# EAGLE design candy_v0001 (EAGLE 7.2.0)
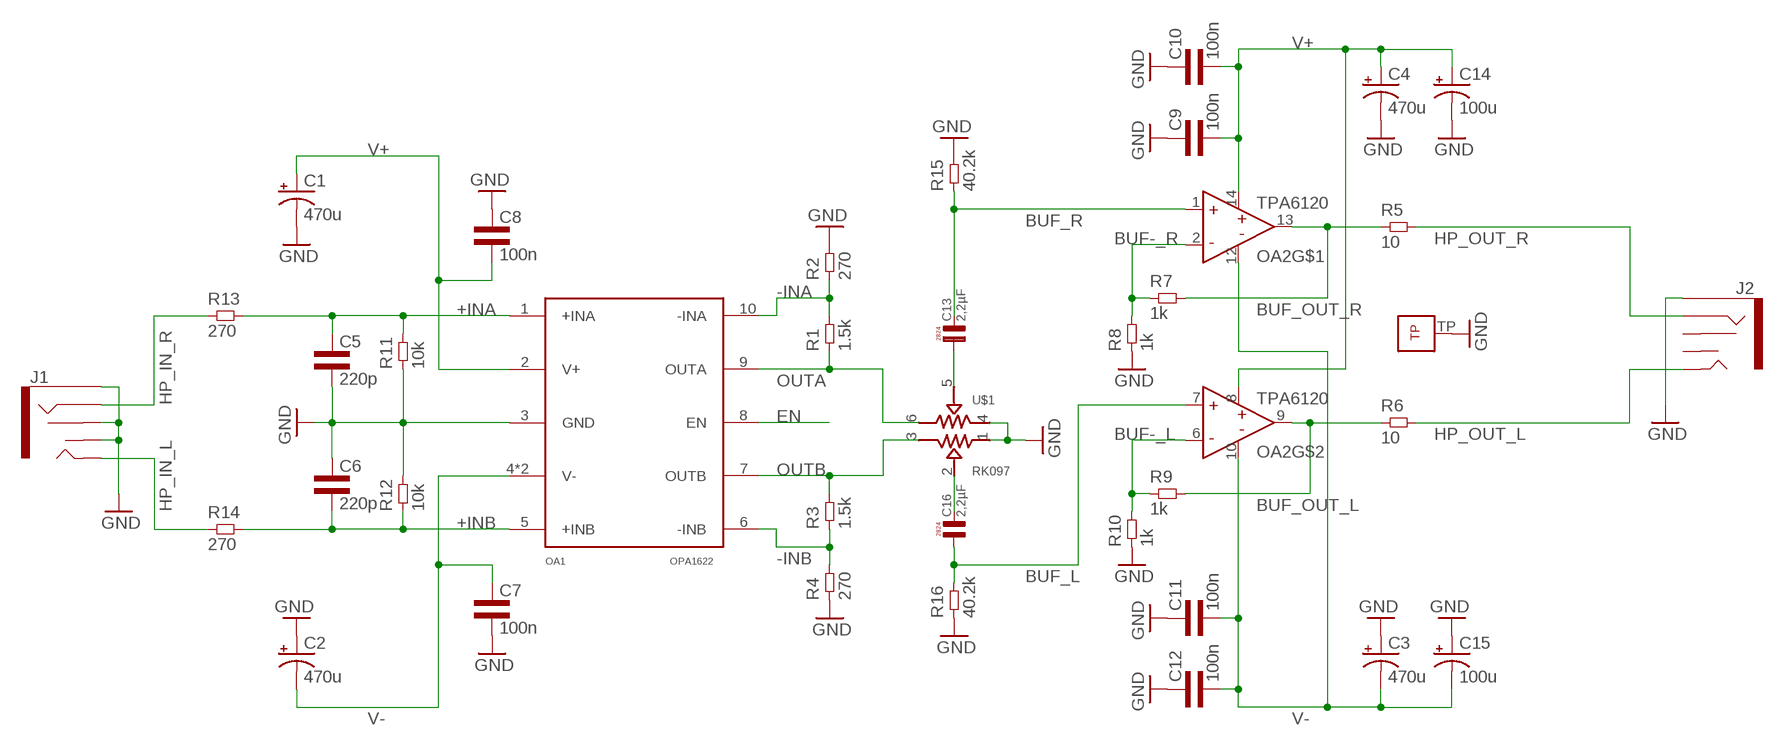
[diagram p0: schematic, sheet 1]

## Parts
C1  470u  CPOL-USF  [PANASONIC_F]
C2  470u  CPOL-USF  [PANASONIC_F]
C3  470u  CPOL-USF  [PANASONIC_F]
C4  470u  CPOL-USF  [PANASONIC_F]
C5  220p  CAP0805L3  [0805L3]
C6  220p  CAP0805L3  [0805L3]
C7  100n  CAP0603L3  [0603L3]
C8  100n  CAP0603L3  [0603L3]
C9  100n  CAP0603L3  [0603L3]
C10  100n  CAP0603L3  [0603L3]
C11  100n  CAP0603L3  [0603L3]
C12  100n  CAP0603L3  [0603L3]
C13  2,2µF  [L7,2]
C14  100u  CPOL-USD  [PANASONIC_D]
C15  100u  CPOL-USD  [PANASONIC_D]
C16  2,2µF  [L7,2]
J1  AUDIO-JACK2SMD  [AUDIO-JACK-3.5MM-SMD]
J2  AUDIO-JACK2SMD  [AUDIO-JACK-3.5MM-SMD]
OA1  OPA1622  [S-PVSON-N10]
OA2  TPA6120QFN  [S-PVQFN-N14]
R1  1.5k  RES0603L3  [0603L3]
R2  270  RES0603L3  [0603L3]
R3  1.5k  RES0603L3  [0603L3]
R4  270  RES0603L3  [0603L3]
R5  10  RES1206L3  [1206L3]
R6  10  RES1206L3  [1206L3]
R7  1k  RES0603L3  [0603L3]
R8  1k  RES0603L3  [0603L3]
R9  1k  RES0603L3  [0603L3]
R10  1k  RES0603L3  [0603L3]
R11  10k  RES0603L3  [0603L3]
R12  10k  RES0603L3  [0603L3]
R13  270  RES0603L3  [0603L3]
R14  270  RES0603L3  [0603L3]
R15  40.2k  RES0603L3  [0603L3]
R16  40.2k  RES0603L3  [0603L3]
U$1  RK097  [RK097]

## Nets
+INA: C5.1 OA1.1(+INA) R11.P$2 R13.P$2
+INB: C6.2 OA1.5(+INB) R12.P$1 R14.P$2
-INA: OA1.10(-INA) R1.P$2 R2.P$1
-INB: OA1.6(-INB) R3.P$1 R4.P$2
BUF-_L: OA2.6(IN-) R9.P$1 R10.P$2
BUF-_R: OA2.2(IN-) R7.P$1 R8.P$2
BUF_L: C16.P$1 OA2.7(IN+) R16.P$2
BUF_OUT_L: OA2.9(OUT) R6.1 R9.P$2
BUF_OUT_R: OA2.13(OUT) R5.1 R7.P$2
BUF_R: C13.P$2 OA2.1(IN+) R15.P$1
EN: OA1.8(EN)
GND: C1.- C2.+ C3.+ C4.- C5.2 C6.1 C7.P$2 C8.P$1 C9.P$1 C10.P$1 C11.P$1 C12.P$1 C14.- C15.+ J1.RSH J1.SLEEVE J1.TSH J2.SLEEVE OA1.3(GND) OA2.TP R2.P$2 R4.P$1 R8.P$1 R10.P$1 R11.P$1 R12.P$2 R15.P$2 R16.P$1 U$1.1 U$1.4
HP_IN_L: J1.TIP R14.P$1
HP_IN_R: J1.RING R13.P$1
HP_OUT_L: J2.TIP R6.2
HP_OUT_R: J2.RING R5.2
OUTA: OA1.9(OUTA) R1.P$1 U$1.6
OUTB: OA1.7(OUTB) R3.P$2 U$1.3
V+: C1.+ C4.+ C8.P$2 C9.P$2 C10.P$2 C14.+ OA1.2(V+) OA2.8(V+) OA2.14(V+)
V-: C2.- C3.- C7.P$1 C11.P$2 C12.P$2 C15.- OA1.4(V-) OA1.TP(V-) OA2.10(V-) OA2.12(V-)
VOL_L: C16.P$2 U$1.2
VOL_R: C13.P$1 U$1.5
Unconnected: J2.RSH J2.TSH

## Library data of the parts
C1-C4 C14 C15 = rcl:CPOL-US: POLARIZED CAPACITOR, American symbol
C5-C12 = common:CAP
C13 C16 = Capacitor-Wima-SMD2824-63v:2,2µF
J1 J2 = SparkFun-Connectors:AUDIO-JACK2: Stereo audio jack with bypass switches. Used on LilyPad MP3 board. Production SKU: CONN-10353; PROD_ID: CONN-10353
OA1 = common:OPA1622
OA2 = common:TPA6120
R1-R16 = common:RES
U$1 = SparkFun-Electromechanical:RK097

## Board
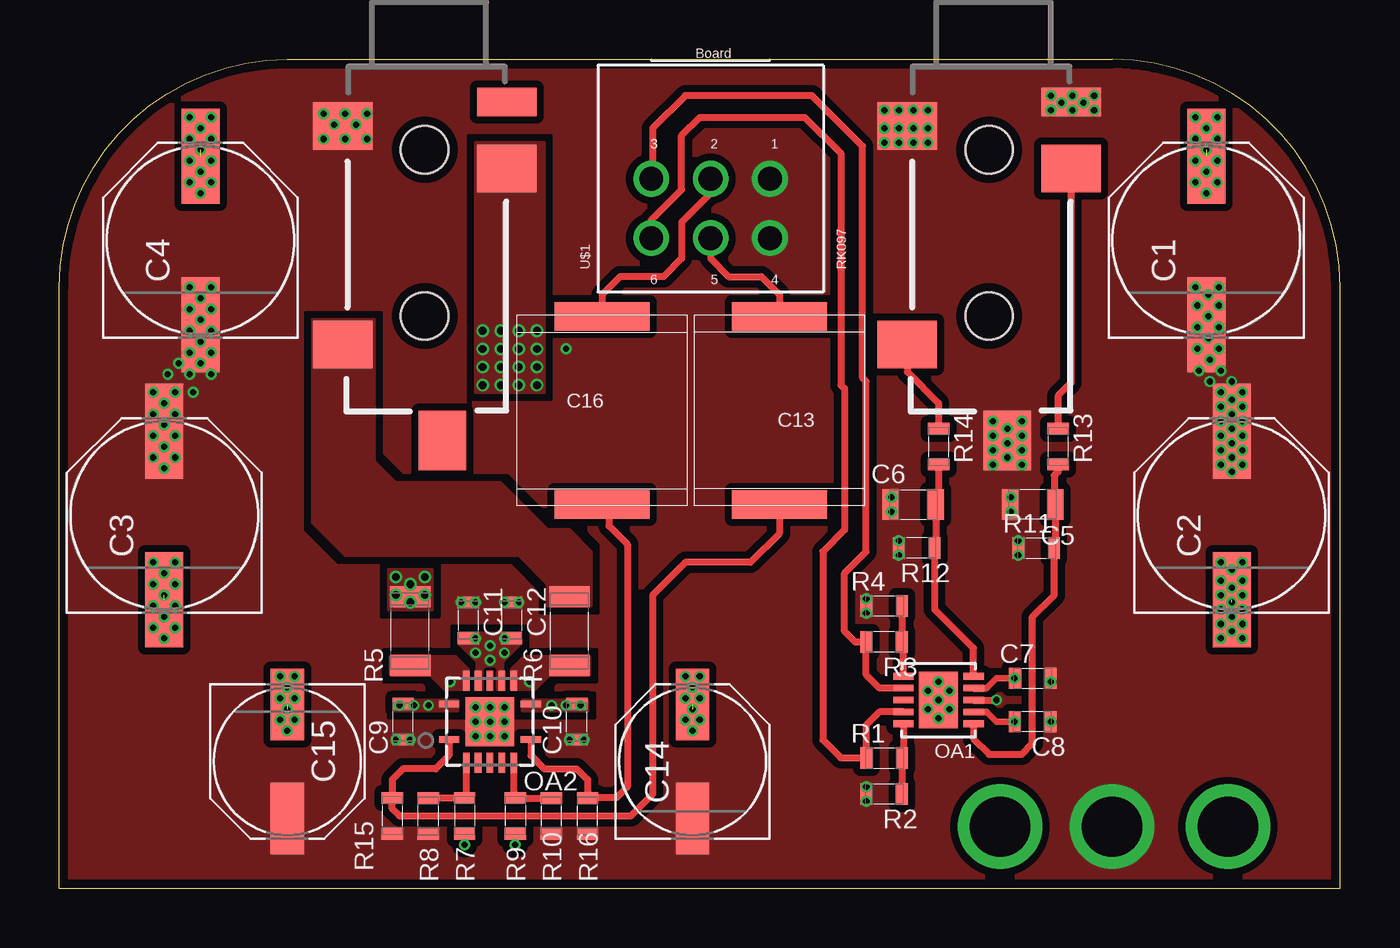
[diagram p1: board, top side]
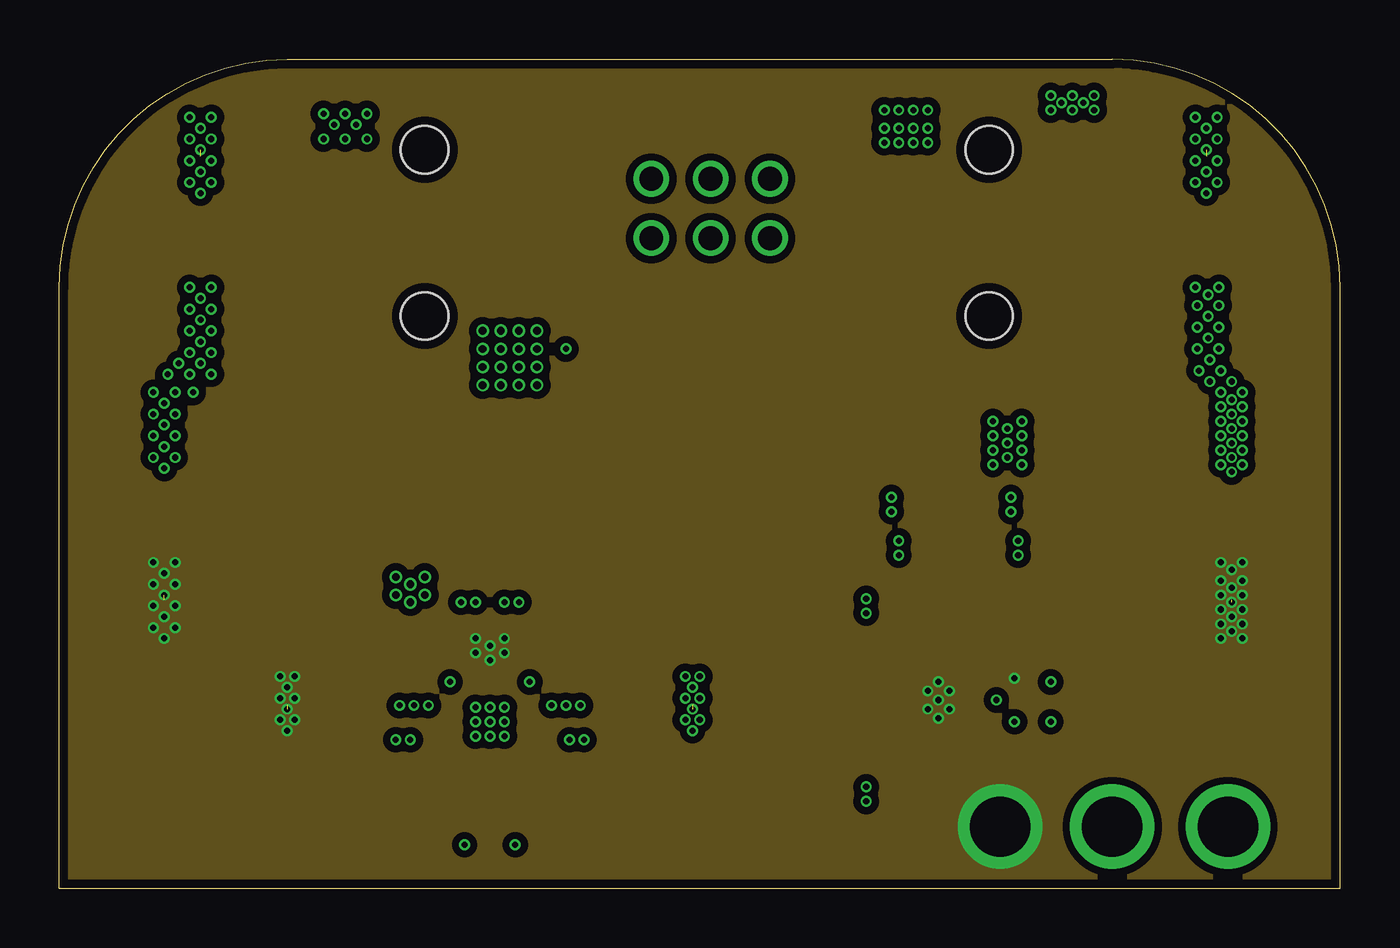
[diagram p2: board, inner layer Route2]
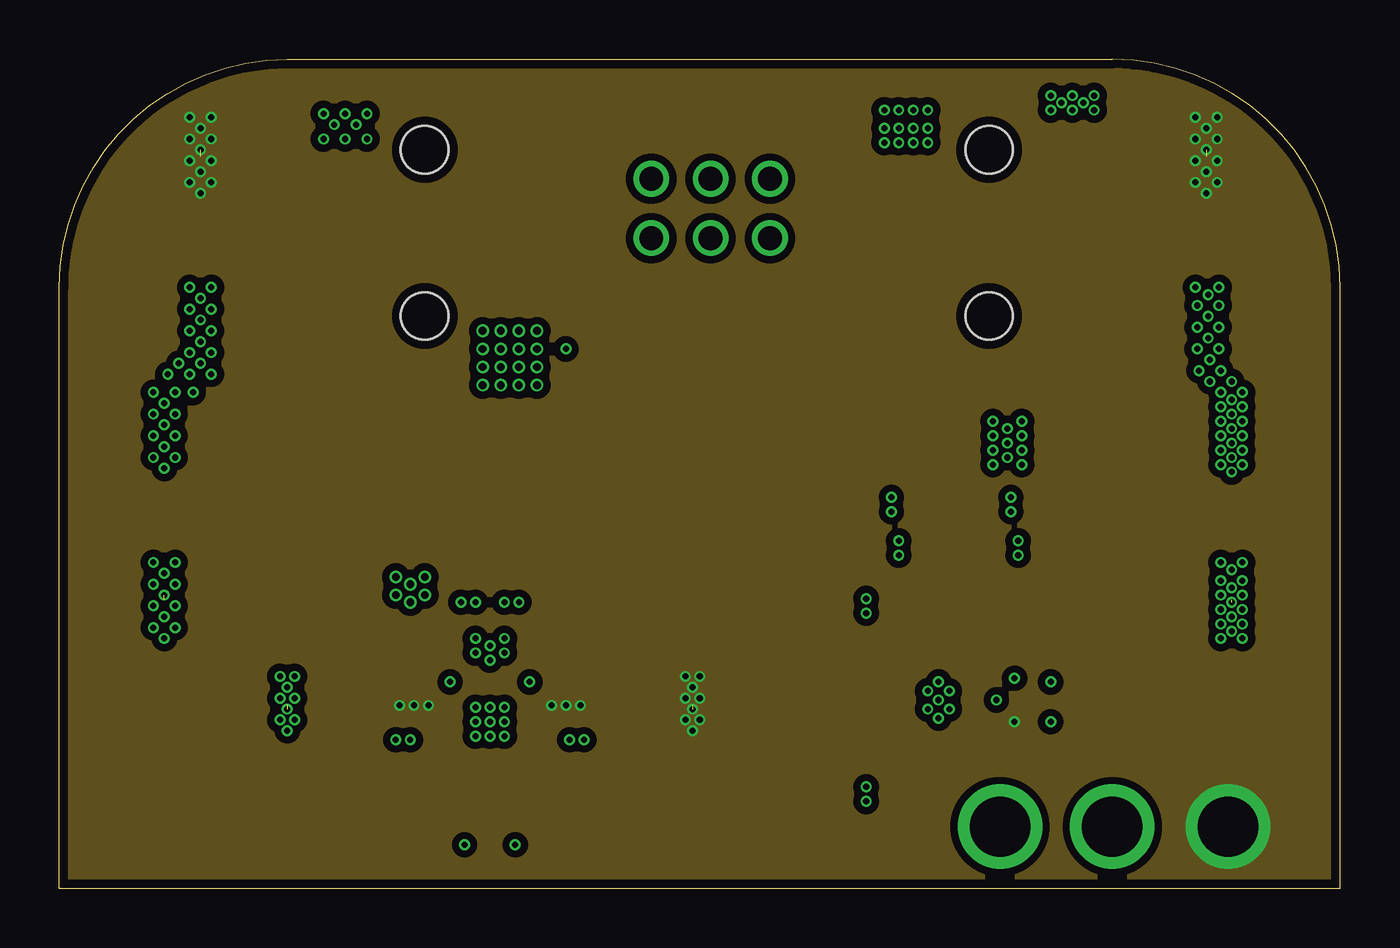
[diagram p3: board, inner layer Route3]
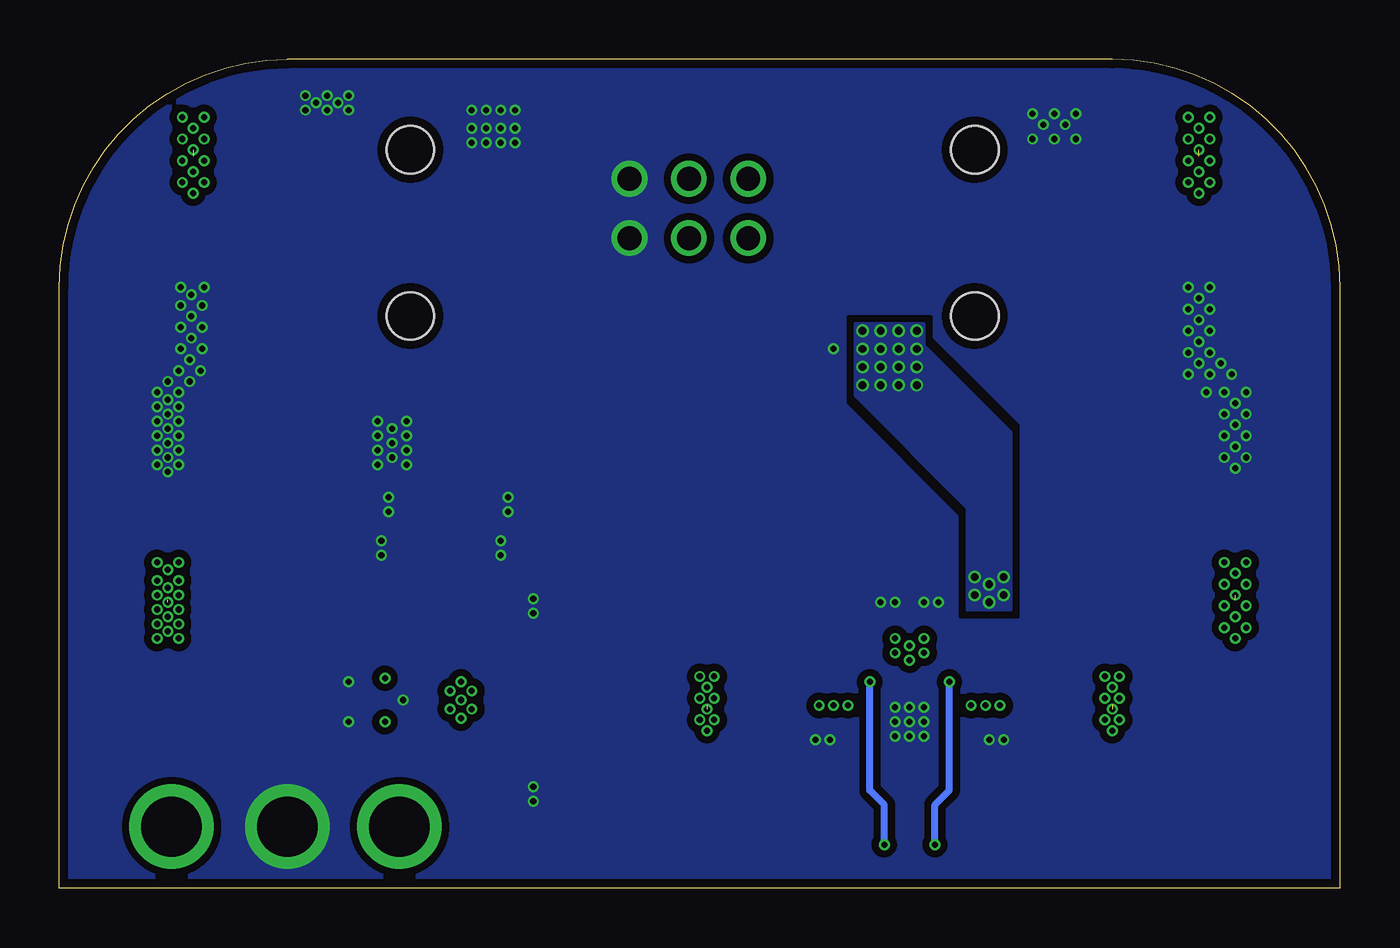
[diagram p4: board, bottom side, seen from below]

Size 53.95 x 34.9 mm. Coordinates in mm from the lower left corner, seen from the top.
Outline: 0,0 53.95,0 53.95,25.3 arc90 44.35,34.9 9.6,34.9 arc90 0,25.3 0,0
Copper layers (1*2*3*16): Top 0.035559375mm / dielectric 0.17018125mm / Route2 0.01778125mm / dielectric 47mil / Route3 0.0356mm / dielectric 0.2007mm / Bottom 0.035559375mm
Design rules "OSHPark-4layer": minimum track width 5mil, minimum drill 10mil, track to track 5mil, track to pad 5mil, pad to pad 5mil, via to via 5mil, smd to smd 5mil, copper to edge 15mil, drill to drill 6mil, minimum pad ring 4mil, minimum via ring 4mil, stop-mask expansion 4mil, vias tented up to drill 21mil, thermal gap 10mil

### Footprints (pad centres in the part's own frame; a part is rotated, then mirrored left to right if it is on the bottom)
PANASONIC_F = smd 4 x 1.6: + 3.55,0; - -3.55,0
0805L3 = smd 0.7 x 1.3: 1 -0.95,0; 2 0.95,0
0603L3 = smd 0.5 x 0.9: P$1 -0.75,0; P$2 0.75,0
L7,2 = smd 4 x 1.2: P$1 0,-3.95; P$2 0,3.95
PANASONIC_D = smd 3 x 1.4: + 2.4,0; - -2.4,0
AUDIO-JACK-3.5MM-SMD = smd 2 x 2.5: RING 4.3,3.45; SLEEVE 2.5,-3.45; TIP 11.7,-3.45 | smd 1.2 x 2.5: RSH 1.5,3.45 | smd 2.5 x 2: TSH 15.75,0.75 | hole 2: 3.5,0; 10.5,0
S-PVSON-N10 = smd 0.28 x 0.85: 1 -1,-1.475; 2 -0.5,-1.475; 3 0,-1.475; 4 0.5,-1.475; 5 1,-1.475; 6 1,1.475; 7 0.5,1.475; 8 0,1.475; 9 -0.5,1.475; 10 -1,1.475 | smd 2.4 x 1.65: TP 0,0
S-PVQFN-N14 = smd 0.85 x 0.28: 1 -1.725,-0.75; 7 1.725,-0.75; 8 1.725,0.75; 14 -1.725,0.75 | smd 0.28 x 0.85: 2 -1,-1.725; 3 -0.5,-1.725; 4 0,-1.725; 5 0.5,-1.725; 6 1,-1.725; 9 1,1.725; 10 0.5,1.725; 11 0,1.725; 12 -0.5,1.725; 13 -1,1.725 | smd 2.05 x 2.05: TP 0,0
1206L3 = smd 0.9 x 1.7: 1 -1.45,0; 2 1.45,0
RK097 = drill 1: 1 2.5,0; 2 0,0; 3 -2.5,0; 4 2.5,-2.5; 5 0,-2.5; 6 -2.5,-2.5

### Placement (x,y rotation side)
C1  48.31,27.28 90 top
C2  49.38,15.7 90 top
C3  4.42,15.7 90 top
C4  5.94,27.28 90 top
C5  41,16.15 180 top
C6  35.97,16.15 0 top
C7  41,8.84 0 top
C8  41,7.01 180 top
C9  14.48,7.01 90 top
C10  21.79,7.01 90 top
C11  17.22,11.28 270 top
C12  19.05,11.28 270 top
C13  30.33,20.12 180 top
C14  26.67,5.33 90 top
C15  9.6,5.33 270 top
C16  22.86,20.12 0 top
J1  39.17,34.59 270 top
J2  15.39,34.59 270 top
OA1  37.03,7.92 90 top
OA2  18.14,7.01 0 top
R1  34.75,5.49 0 top
R2  34.75,3.96 180 top
R3  34.75,10.36 180 top
R4  34.75,11.89 0 top
R5  14.78,10.82 90 top
R6  21.49,10.82 90 top
R7  17.07,3.05 270 top
R8  15.54,3.05 90 top
R9  19.2,3.05 270 top
R10  20.73,3.05 90 top
R11  41.15,14.33 0 top
R12  36.12,14.33 180 top
R13  42.06,18.59 270 top
R14  37.03,18.59 270 top
R15  14.02,3.05 270 top
R16  22.25,3.05 90 top
U$1  27.43,29.87 0 top

### Tracks (layer width: path | path; a pad name or v marks a point on that pad's centre or on a via)
+INA
  Top 0.305: R13.P$2 42.06,17.53 41.91,17.37 41.91,16.19 C5.1 41.95,14.37 R11.P$2 41.91,14.31 41.91,12.34 41,11.43 41,6.1 40.54,5.64 39.17,5.64 38.51,6.3 OA1.1
+INB
  Top 0.305: R14.P$2 37.03,16.27 C6.2 36.92,14.37 R12.P$1 36.87,11.75 38.51,10.11 OA1.5
-INA
  Top 0.305: OA1.10 35.56,5.55 R1.P$2 R2.P$1
-INB
  Top 0.305: OA1.6 35.56,10.3 R3.P$1 R4.P$2
BUF-_L
  Top 0.305: OA2.6 19.14,3.86 R9.P$1 R10.P$2
BUF-_R
  Top 0.305: OA2.2 17.14,3.86 R7.P$1 R8.P$2
BUF_L
  Top 0.305: C16.P$1 23.15,16.17 23.15,15.25 23.93,14.48 23.93,4.27 23.47,3.81 22.26,3.81 R16.P$2 22.25,4.57 21.79,5.03 20.42,5.03 19.86,5.59 OA2.7
BUF_OUT_L  (via drill 0.25)
  Top 0.292: R9.P$2 v19.2,1.83
  Bottom 0.292: v19.2,1.83 19.2,3.5 19.81,4.11 v19.81,8.69
  pour Top (no thermals): 19.05,8.38 19.05,9.22 19.58,9.75 22.33,9.75 22.33,8.99 20.65,8.99 20.04,8.38
BUF_OUT_R  (via drill 0.25)
  Top 0.292: R7.P$2 v17.07,1.83
  Bottom 0.292: v17.07,1.83 17.07,3.5 16.46,4.11 v16.46,8.69
  pour Top (no thermals): 17.22,8.38 17.22,9.22 16.69,9.75 13.94,9.75 13.94,8.99 15.62,8.99 16.23,8.38
BUF_R
  Top 0.305: C13.P$2 30.33,14.93 29.11,13.72 26.36,13.72 24.99,12.34 24.99,3.96 24.08,3.05 14.33,3.05 14.02,3.35 R15.P$1 14.02,4.57 14.48,5.03 15.85,5.03 16.41,5.59 OA2.1
GND  (via drill 0.25, 2.54)
  Top 0.292: OA1.3 v39.47,7.92
  other vias: 18.14,7.01 34.75,32.77 41.76,33.38 39.32,19.66 47.85,25.3 48.92,20.88 17.53,7.62 18.14,7.62 18.75,7.62 17.53,7.01 18.75,7.01 17.53,6.4 18.14,6.4 18.75,6.4 14.17,6.25 14.78,6.25 21.49,6.25 22.1,6.25 16.92,12.04 17.53,12.04 18.75,12.04 19.35,12.04 35.05,16.46 35.05,15.85 35.36,14.63 35.36,14.02 40.39,14.02 40.39,14.63 40.08,15.85 40.08,16.46 44.35,2.59 33.99,4.27 33.99,3.66 33.99,12.19 33.99,11.58 11.13,32.61 12.04,32.61 12.95,32.61 12.5,32.16 11.58,32.16 11.13,31.55 12.04,31.55 12.95,31.55 3.96,20.88 4.88,20.88 4.42,20.42 3.96,19.96 4.88,19.96 4.42,19.51 3.96,19.05 4.88,19.05 4.42,18.59 3.96,18.14 4.88,18.14 4.42,17.68 5.49,25.3 6.4,25.3 5.94,24.84 5.49,24.38 6.4,24.38 5.94,23.93 5.49,23.47 6.4,23.47 5.94,23.01 5.49,22.56 6.4,22.56 5.94,22.1 49.83,20.88 49.38,20.57 48.92,20.27 49.83,20.27 49.38,19.96 48.92,19.66 49.83,19.66 49.38,19.35 48.92,19.05 49.83,19.05 49.38,18.75 48.92,18.44 49.83,18.44 49.38,18.14 48.92,17.83 49.83,17.83 49.38,17.53 40.54,19.66 39.93,19.35 39.32,19.05 40.54,19.05 39.93,18.75 39.32,18.44 40.54,18.44 39.93,18.14 34.75,31.39 35.36,32.77 35.97,32.77 36.58,32.77 35.36,31.39 35.97,31.39 36.58,31.39 34.75,32 35.36,32 35.97,32 36.58,32 41.76,32.77 42.21,33.07 42.67,33.38 42.67,32.77 43.13,33.07 43.59,33.38 43.59,32.77 5.03,22.1 5.49,21.64 6.4,21.64 4.57,21.64 5.64,20.88 49.38,21.34 48.46,21.34 48.92,21.79 48.01,21.79 48.46,22.25 47.93,22.71 48.84,22.71 48.39,23.16 47.93,23.62 48.84,23.62 48.39,24.08 47.93,24.54 48.84,24.54 48.39,24.99 48.84,25.3 39.32,17.83 40.54,17.83 41.76,8.69 41.76,7.01 21.34,22.71
  pour Top (no thermals): 5.18,25.76 5.18,22.86 3.66,21.34 3.66,17.22 5.18,17.22 5.18,20.12 6.71,21.64 6.71,25.76
  pour Top (no thermals): 48.62,17.22 48.62,20.73 47.55,21.79 47.55,25.76 49.07,25.76 49.07,22.25 50.14,21.18 50.14,17.22
  pour Top (no thermals): 41.3,33.68 43.89,33.68 43.89,32.46 41.3,32.46
  pour Top (no thermals): 34.44,33.07 36.88,33.07 36.88,31.09 34.44,31.09
  pour Top (no thermals): 41,20.12 38.86,20.12 38.86,17.53 41,17.53
  pour Top (no thermals): 35.66,14.94 35.05,14.94 35.05,13.72 35.66,13.72
  pour Top (no thermals): 40.69,14.94 40.08,14.94 40.08,13.72 40.69,13.72
  pour Top (no thermals): 34.29,12.5 33.68,12.5 33.68,11.28 34.29,11.28
  pour Top (no thermals): 34.29,4.57 33.68,4.57 33.68,3.35 34.29,3.35
  pour Top (no thermals): 21.18,6.55 21.18,5.94 22.4,5.94 22.4,6.55
  pour Top (no thermals): 13.87,6.55 13.87,5.94 15.09,5.94 15.09,6.55
  pour Top (no thermals): 16.61,12.34 16.61,11.73 17.83,11.73 17.83,12.34
  pour Top (no thermals): 18.44,12.34 18.44,11.73 19.66,11.73 19.66,12.34
  pour Top (no thermals): 35.36,16.76 34.75,16.76 34.75,15.54 35.36,15.54
  pour Top (no thermals): 40.39,16.76 39.78,16.76 39.78,15.54 40.39,15.54
  pour Top (isolate 0.305, rank 6, no thermals): 0.15,0.15 0.15,25.3 arc-90 9.6,34.75 44.5,34.75 arc-90 53.8,25.45 53.8,0.15
  pour Bottom (isolate 0.305, rank 6, no thermals): 0.15,0.15 0.15,25.3 arc-90 9.6,34.75 44.5,34.75 arc-90 53.8,25.45 53.8,0.15
HP_IN_L
  Top 0.305: J1.TIP 35.72,21.74 37.03,20.42 R14.P$1
HP_IN_R
  Top 0.305: J1.RING 42.62,21.28 42.06,20.73 R13.P$1
HP_OUT_L
  pour Top (no thermals): 10.67,23.93 10.67,15.39 12.04,14.02 19.35,14.02 20.57,12.8 20.57,11.89 22.4,11.89 22.4,14.17 21.49,15.09 20.57,15.09 18.59,17.07 14.17,17.07 13.26,17.98 13.26,23.93
HP_OUT_R  (via drill 0.33)
  other vias: 14.17,13.11 14.78,12.8 14.17,12.34 14.78,12.04 15.39,12.34 15.39,13.11 17.83,23.47 18.59,23.47 19.35,23.47 20.12,23.47 17.83,22.71 18.59,22.71 19.35,22.71 20.12,22.71 17.83,21.95 18.59,21.95 19.35,21.95 20.12,21.95 17.83,21.18 18.59,21.18 19.35,21.18 20.12,21.18
  pour Top (no thermals): 13.87,11.73 13.87,13.41 15.7,13.41 15.7,11.73
  pour Top (no thermals): 17.53,31.39 17.53,20.88 20.42,20.88 20.42,31.39
  pour Bottom (no thermals): 13.87,11.73 13.87,19.2 17.53,22.86 17.53,23.77 20.42,23.77 20.42,20.73 15.7,16 15.7,11.73
OUTA
  Top 0.292: OA1.9 34.55,7.42
  Top 0.305: 34.55,7.42 33.98,6.86 33.98,5.5 R1.P$1 32.92,5.49 32.16,6.25 32.16,14.17 33.07,15.09 33.07,21.03 32.92,21.18 32.92,30.94 31.39,32.46 26.98,32.46 26.21,31.7 26.21,29.41 24.93,28.13 U$1.6
OUTB
  Top 0.292: OA1.7 34.55,8.42
  Top 0.305: 34.55,8.42 33.98,8.99 33.98,10.35 R3.P$2 33.53,10.36 33.07,10.82 33.07,13.26 33.98,14.17 33.98,21.34 33.83,21.49 33.83,31.24 31.7,33.38 26.36,33.38 24.99,32 24.99,29.93 U$1.3
V+  (via drill 0.25, 2.54)  (3 unrouted)
  Top 0.279: 39.06,7.42 39.47,7.01 v40.23,7.01 C8.P$2
  Top 0.292: OA1.2 39.06,7.42
  other vias: 5.49,32.46 6.4,32.46 5.94,32 5.49,31.55 6.4,31.55 5.94,31.09 5.49,30.63 6.4,30.63 5.94,30.18 5.49,29.72 6.4,29.72 5.94,29.26 47.85,32.46 48.77,32.46 48.31,32 47.85,31.55 48.77,31.55 48.31,31.09 47.85,30.63 48.77,30.63 48.31,30.18 47.85,29.72 48.77,29.72 48.31,29.26 26.37,8.92 49.23,2.59 21.34,7.7 21.95,7.7 14.94,7.7 14.33,7.7 26.97,8.92 26.67,8.46 26.37,8 26.97,8 26.67,7.54 26.37,7.09 26.97,7.09 26.67,6.63 15.54,7.7 20.73,7.7
  pour Top (no thermals): 16.76,7.92 14.17,7.92 14.17,7.47 16.76,7.47
  pour Top (no thermals): 19.51,7.92 19.51,7.47 22.25,7.47 22.25,7.92
  pour Route3 (isolate 0.305, no thermals): 0.15,0.15 0.15,25.3 arc-90 9.6,34.75 44.5,34.75 arc-90 53.8,25.45 53.8,0.15
V-  (via drill 0.25, 2.54)  (3 unrouted)
  Top 0.279: 39.06,8.42 39.47,8.84 v40.23,8.84 C7.P$1
  Top 0.292: OA1.4 39.06,8.42
  other vias: 48.92,13.72 3.96,13.72 9.3,8.92 18.14,9.6 39.62,2.59 37.03,7.92 37.03,8.69 37.03,7.16 36.58,7.54 36.58,8.31 37.49,8.31 37.49,7.54 4.88,13.72 4.42,13.26 3.96,12.8 4.88,12.8 4.42,12.34 3.96,11.89 4.88,11.89 4.42,11.43 3.96,10.97 4.88,10.97 4.42,10.52 9.91,8.92 9.6,8.46 9.3,8 9.91,8 9.6,7.54 9.3,7.09 9.91,7.09 9.6,6.63 49.83,13.72 49.38,13.41 48.92,12.95 49.83,12.95 49.38,12.65 48.92,12.34 49.83,12.34 49.38,12.04 48.92,11.73 49.83,11.73 49.38,11.43 48.92,11.13 49.83,11.13 49.38,10.82 48.92,10.52 49.83,10.52 17.53,9.91 18.75,9.91 18.14,10.21 17.53,10.52 18.75,10.52
  pour Top (no thermals): 17.6,8.38 17.6,9.53 16.84,10.29 16.84,10.74 19.43,10.74 19.43,10.29 18.67,9.53 18.67,8.38
  pour Route2 (isolate 0.305, rank 6, no thermals): 0.15,0.15 0.15,25.3 arc-90 9.6,34.75 44.5,34.75 arc-90 53.8,25.45 53.8,0.15
VOL_L
  Top 0.305: U$1.2 27.43,29.26 26.21,28.04 26.21,26.52 25.45,25.76 23.62,25.76 22.86,24.99 C16.P$2
VOL_R
  Top 0.305: U$1.5 27.43,26.52 28.19,25.76 29.57,25.76 30.33,24.99 C13.P$1